# EasyEDA schematic OpenTCUSandwich.json
TITLE: Sheet_1; REV: 1.0; Date: 2024-07-19; Sheet: 1/1; Drawn By: tristan.read1508; Company: Your Company
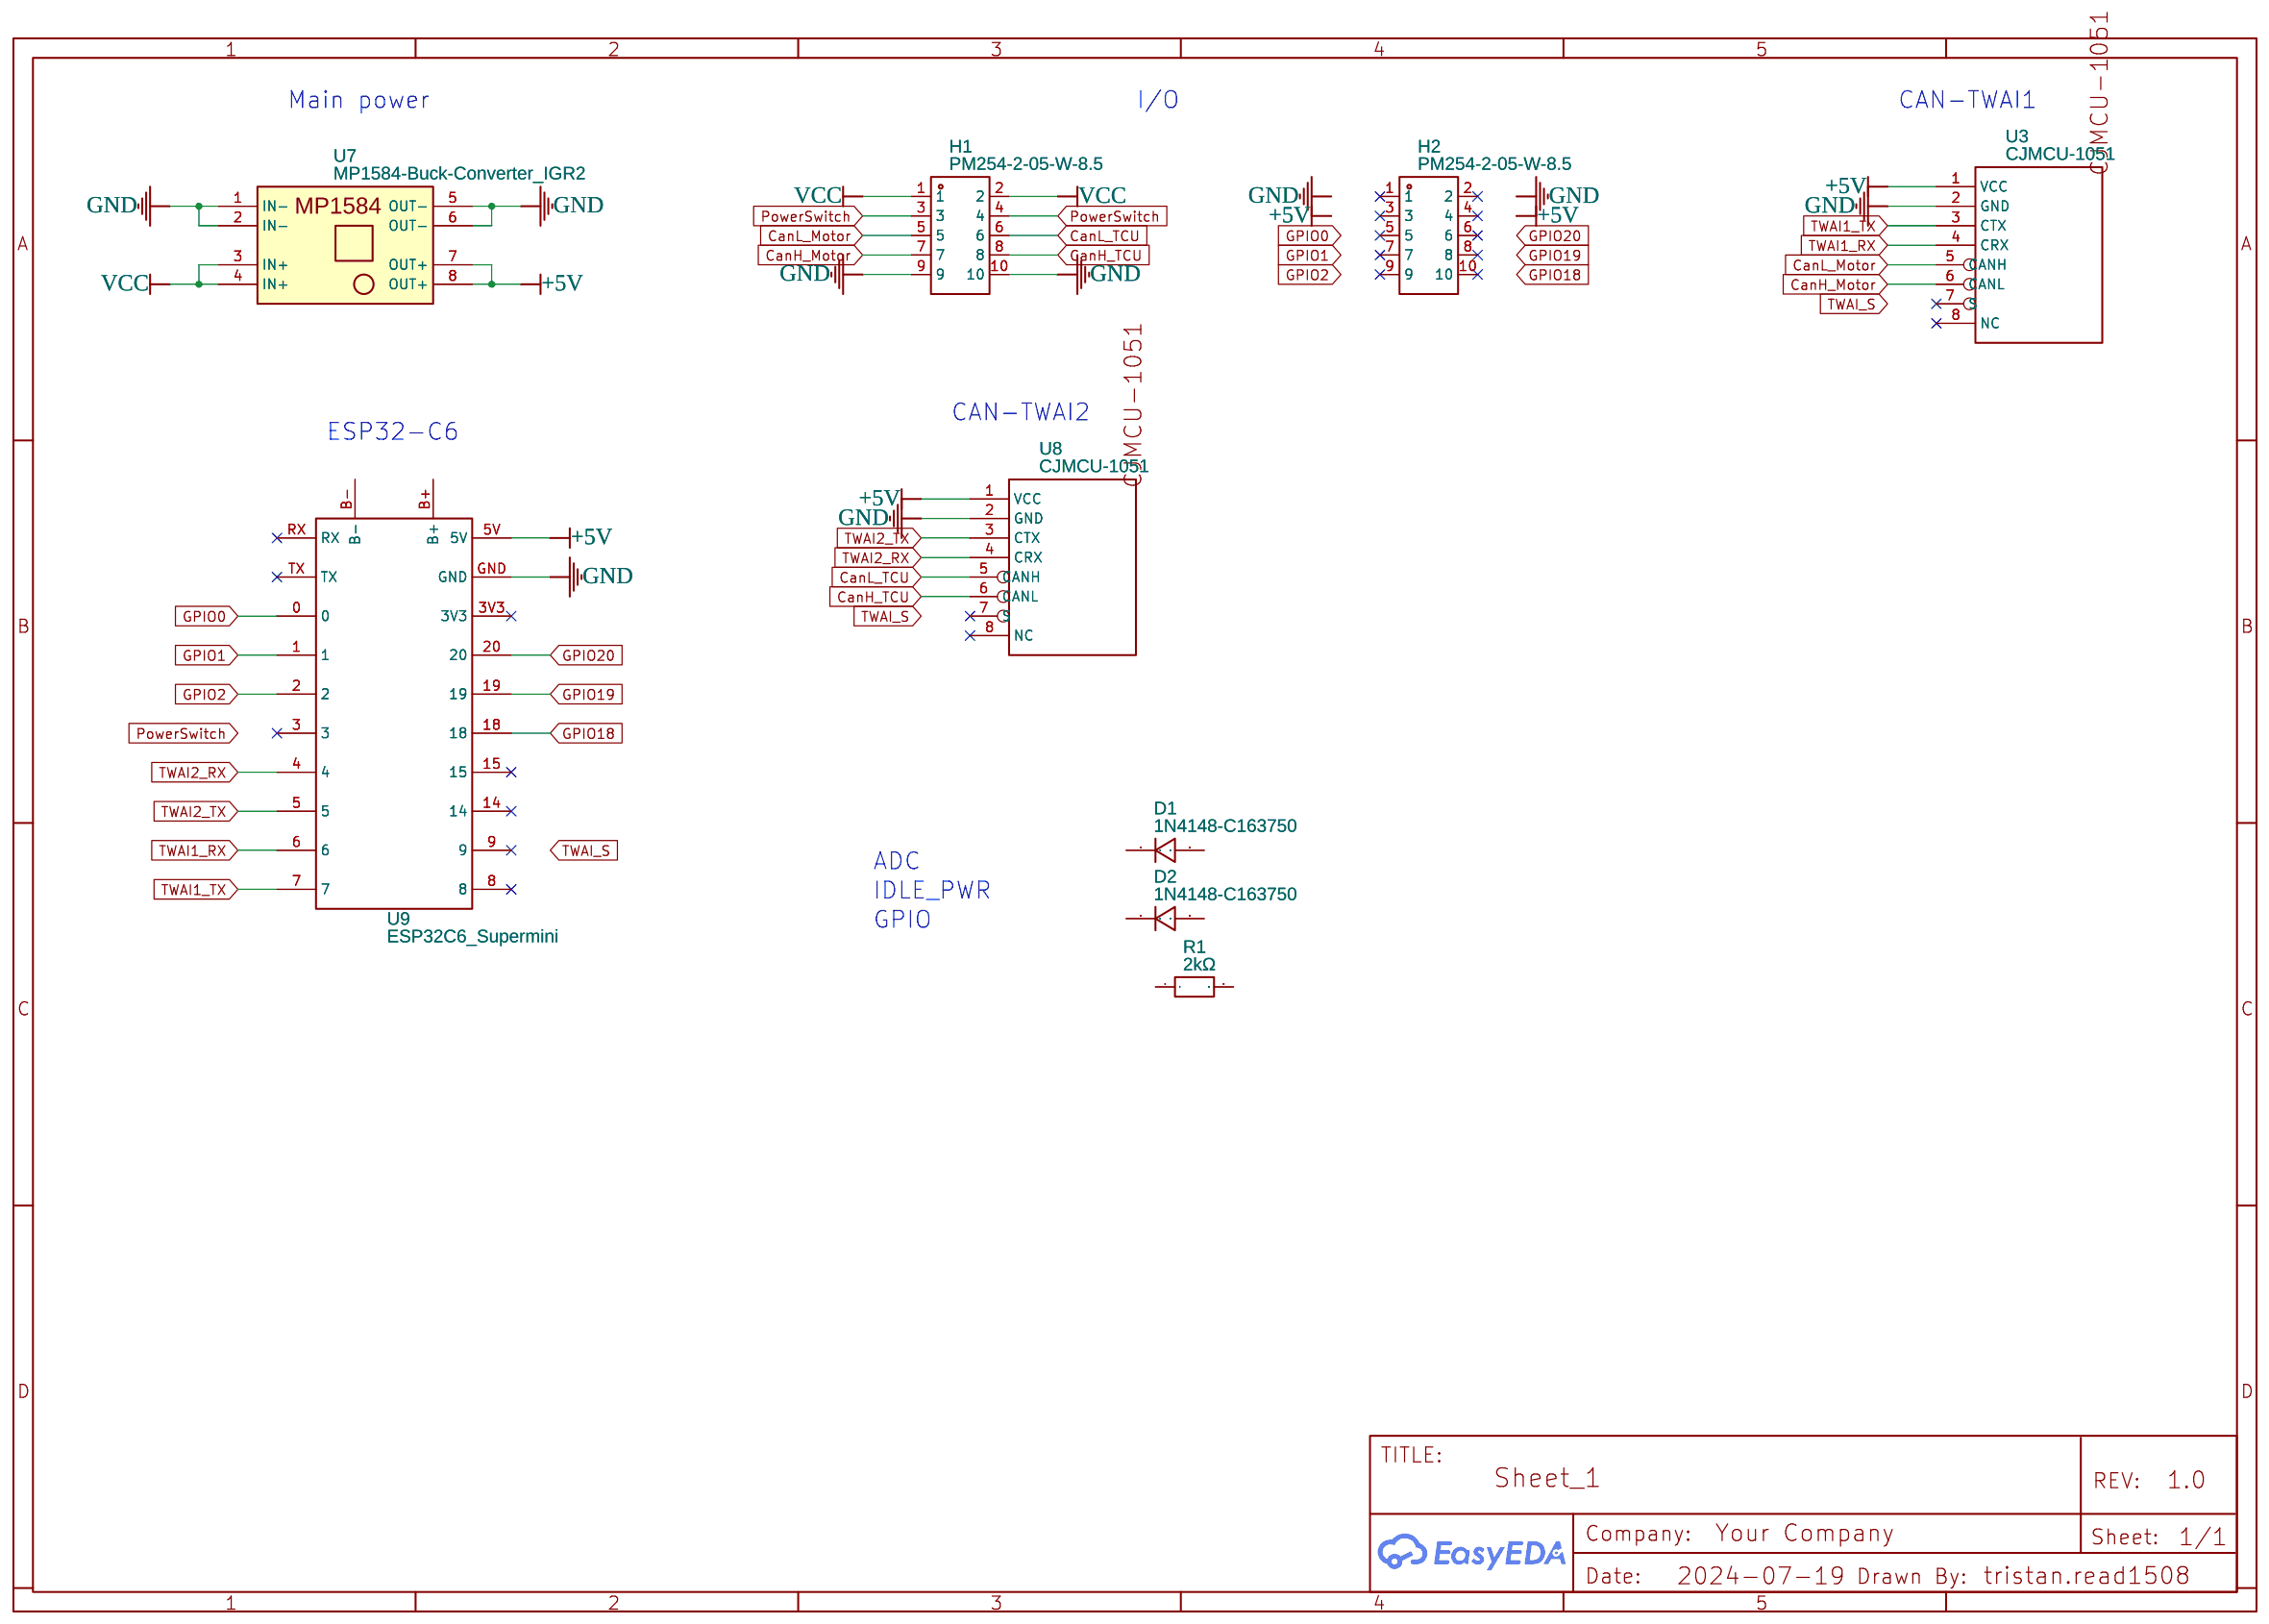
[diagram p0: schematic sheet]

## Parts
D1  1N4148-C163750  [DO-35_BD2.0-L4.2-P8.20-D0.5-RD]
D2  1N4148-C163750  [DO-35_BD2.0-L4.2-P8.20-D0.5-RD]
H1  PM254-2-05-W-8.5  [HDR-TH_10P-P2.54-H-F-R2-C5-W8.5]
H2  PM254-2-05-W-8.5  [HDR-TH_10P-P2.54-H-F-R2-C5-W8.5]
R1  2kΩ  [RES-TH_BD2.4-L6.3-P10.30-D0.6]
U3  CJMCU-1051  [CJMCU-1051]
U7  MP1584-Buck-Converter_IGR2  [MP1584EN-BUCK-CONVERTER]
U8  CJMCU-1051  [CJMCU-1051]
U9  ESP32C6_Supermini  [ESP32-C6-SUPERMINI]

## Library data of the parts
D1 D2 = 1N4148-C163750: Contributor: LCSC; Supplier Part: C163750; Supplier: LCSC; Manufacturer: FMS(美丽微); Manufacturer Part: 1N4148; JLCPCB Part Class: Extended Part
H1 = PM254-2-05-W-8.5: Contributor: LCSC; Supplier: LCSC; Supplier Part: C2897425; Manufacturer: HCTL(华灿天禄); JLCPCB Part Class: Extended Part
H2 = PM254-2-05-W-8.5: Contributor: LCSC; Supplier: LCSC; Supplier Part: C2897425; Manufacturer: HCTL(华灿天禄); JLCPCB Part Class: Extended Part; link: https://lcsc.com/eda_search?q=C2897425&%26type=1&ref=editor
R1 = RN 1/4W 2K F T/B A1: Contributor: LCSC; Supplier: LCSC; Supplier Part: C410663; Manufacturer: Tyohm(幸亚电阻); Manufacturer Part: RN1/4W2KFT/BA1; JLCPCB Part Class: Extended Part
U3 U8 = CJMCU-1051: Contributor: ratedspg10
U7 = MP1584-Buck-Converter_IGR2: Manufacturer Part: MP1584EN; Contributor: fazli wadood
U9 = ESP32C6_Supermini: Contributor: Guest

## Nets
+5V: U3.1(VCC) U7.7(OUT+) U7.8(OUT+) U8.1(VCC) U9.5V
GND: H1.9 H1.10 U3.2(GND) U7.1(IN-) U7.2(IN-) U7.5(OUT-) U7.6(OUT-) U8.2(GND) U9.GND
VCC: H1.1 H1.2 U7.3(IN+) U7.4(IN+)
CanH_Motor: H1.7 U3.6(CANL)
CanH_TCU: H1.8 U8.6(CANL)
CanL_Motor: H1.5 U3.5(CANH)
CanL_TCU: H1.6 U8.5(CANH)
GPIO0: U9.0
GPIO1: U9.1
GPIO2: U9.2
GPIO18: U9.18
GPIO19: U9.19
GPIO20: U9.20
PowerSwitch: H1.3 H1.4
TWAI1_RX: U3.4(CRX) U9.6
TWAI1_TX: U3.3(CTX) U9.7
TWAI2_RX: U8.4(CRX) U9.4
TWAI2_TX: U8.3(CTX) U9.5

Not connected (* = marked no-connect by the designer): D1 1 2; D2 1 2; H2 1* 2* 3* 4* 5* 6* 7* 8* 9* 10*; R1 1 2; U3 7(S)* 8(NC)*; U8 7(S)* 8(NC)*; U9 3* 3V3* 8* 9* 14* 15* B+ B- RX* TX*

## Notes on the sheet
- Main power
- I/O
- CAN-TWAI1
- CAN-TWAI2
- ESP32-C6
- ADC
- IDLE_PWR
- GPIO
